# EAGLE design uc board (EAGLE 9.6.2)
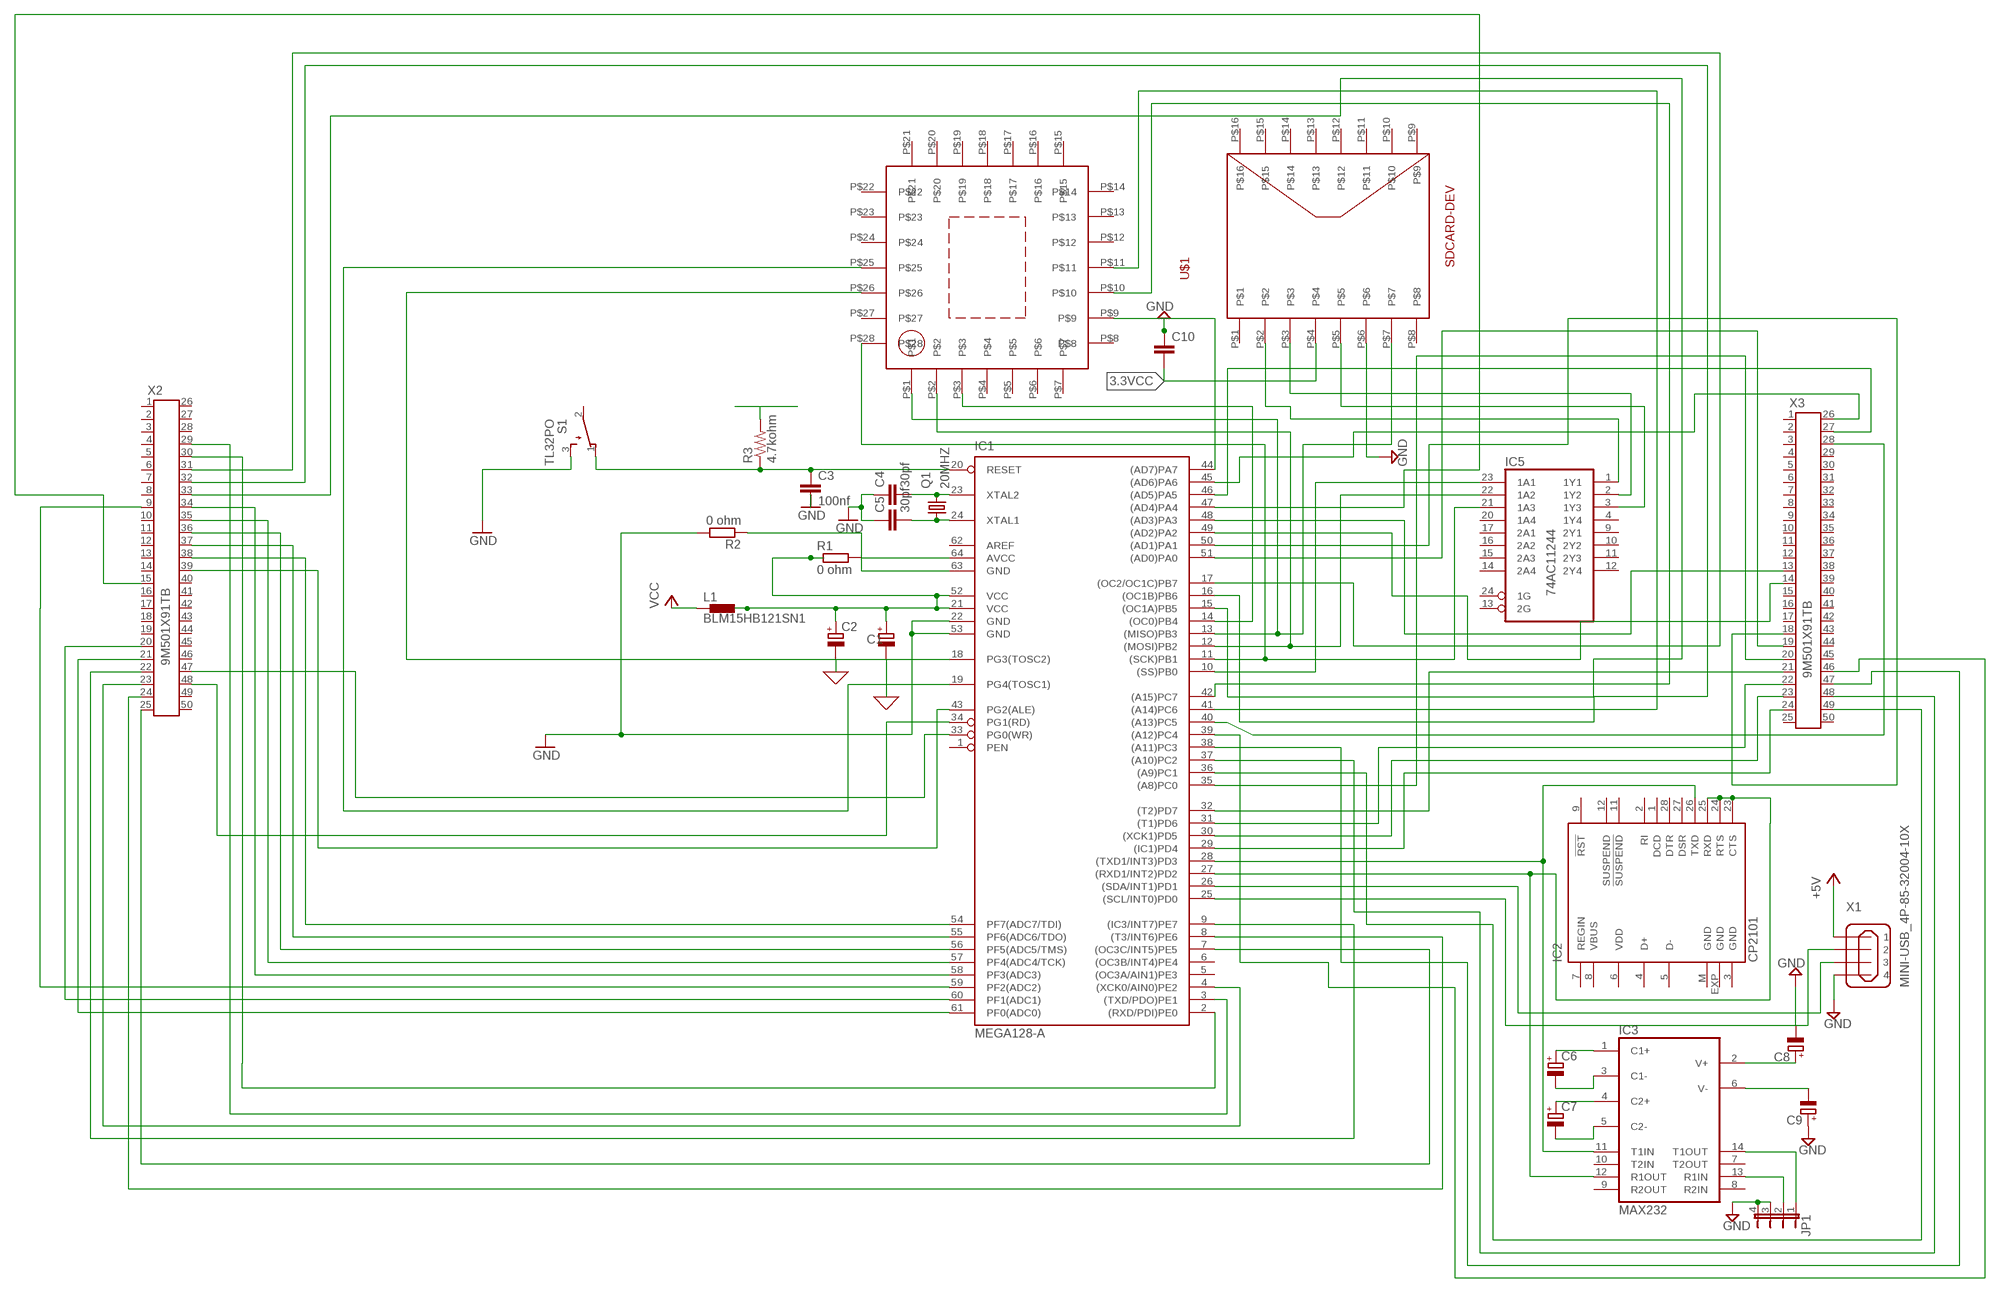
[diagram p0: schematic, sheet 1]

## Parts
C1  CPOL-EU085CS-1AR  [085CS_1AR]
C2  CPOL-EUCT3528  [CT3528]
C3  100nf  C2,5-3  [C2.5-3]
C4  30pf  C2,5-3  [C2.5-3]
C5  30pf  C2,5-3  [C2.5-3]
C6  CPOL-EU085CS-1AR  [085CS_1AR]
C7  CPOL-EU085CS-1AR  [085CS_1AR]
C8  CPOL-EU085CS-1AR  [085CS_1AR]
C9  CPOL-EU085CS-1AR  [085CS_1AR]
C10  C2,5-3  [C2.5-3]
IC1  MEGA128-A  [TQFP64]
IC2  CP2101  [MLP28]
IC3  MAX232  [DIL16]
IC5  74AC11244  [DIL24-6]
JP1  JP4E  [JP4]
L1  BLM15HB121SN1  [0402]
Q1  20MHZ  KX-4  [1.6X1.2]
R1  0 ohm  R-EU_0204/2V  [0204V]
R2  0 ohm  R-EU_0204/2V  [0204V]
R3  4.7kohm  R-US_0204/2V  [0204V]
S1  TL32PO  [TL3XPO]
U$1  SDCARD-DEV  [SDCARD-FOOT]
U$2  CC2520-ZIGBEE-DEV  [CC2520-ZIGBEE-FOOT]
X1  MINI-USB_4P-85-32004-10X  [85-32004-10X]
X2  9M501X91TB  [9M501X91]
X3  9M501X91TB  [9M501X91]

## Nets
0: C1.- C2.- ; supply symbol labelled GND
3.3VCC: C10.2 U$1.P$4
+5V: X1.1
GND: C3.2 C4.1 C5.1 C8.- C9.+ C10.1 IC1.22(GND) IC1.53(GND) JP1.3 JP1.4 R2.2 S1.3(S) U$1.P$6 X1.4
N$1: IC1.14((OC0)PB4) U$2.P$3
N$2: IC1.28((TXD1/INT3)PD3) IC2.26(TXD) IC3.11(T1IN)
N$3: C3.1 IC1.20(RESET) R3.1 S1.1(O)
N$4: IC1.64(AVCC) R1.2
N$5: IC1.27((RXD1/INT2)PD2) IC2.23(CTS) IC2.24(RTS) IC2.25(RXD) IC3.12(R1OUT)
N$6: IC1.63(GND) R2.1
N$7: R3.2
N$9: C4.2 IC1.23(XTAL2) Q1.3
N$10: C5.2 IC1.24(XTAL1) Q1.1
N$11: C6.+ IC3.1(C1+)
N$12: IC3.14(T1OUT) JP1.1
N$13: IC3.13(R1IN) JP1.2
N$14: C6.- IC3.3(C1-)
N$15: C7.+ IC3.4(C2+)
N$16: C8.+ IC3.2(V+)
N$17: C7.- IC3.5(C2-)
N$18: C9.- IC3.6(V-)
N$19: IC1.11((SCK)PB1) IC5.21(1A3) U$2.P$28
N$20: IC1.12((MOSI)PB2) IC5.22(1A2) U$2.P$2
N$21: IC1.10((SS)PB0) IC5.23(1A1)
N$22: IC1.13((MISO)PB3) U$1.P$7 U$2.P$1
N$23: IC5.2(1Y2) U$1.P$3
N$24: IC5.3(1Y3) U$1.P$5
N$25: IC5.1(1Y1) U$1.P$2
N$26: IC1.19(PG4(TOSC1)) U$2.P$25
N$27: C1.+ C2.+ IC1.21(VCC) IC1.52(VCC) L1.2 R1.1
N$28: IC1.18(PG3(TOSC2)) U$2.P$26
N$29: IC1.44((AD7)PA7) U$2.P$9
N$30: IC1.42((A15)PC7) U$2.P$10
N$31: IC1.41((A14)PC6) U$2.P$11
N$32: IC1.26((SDA/INT1)PD1) X1.3
N$33: IC1.25((SCL/INT0)PD0) X1.2
N$34: IC1.43(PG2(ALE)) X2.39
N$35: IC1.54(PF7(ADC7/TDI)) X2.38
N$36: IC1.55(PF6(ADC6/TDO)) X2.37
N$37: IC1.56(PF5(ADC5/TMS)) X2.36
N$38: IC1.57(PF4(ADC4/TCK)) X2.35
N$39: IC1.58(PF3(ADC3)) X2.34
N$40: IC1.15((OC1A)PB5) X2.33
N$41: IC1.2((RXD/PDI)PE0) X2.30
N$42: IC1.16((OC1B)PB6) X2.32
N$43: IC1.17((OC2/OC1C)PB7) X2.31
N$44: IC1.3((TXD/PDO)PE1) X2.29
N$45: IC1.46((AD5)PA5) X3.27
N$46: IC1.45((AD6)PA6) X3.26
N$47: IC1.40((A13)PC5) X3.28
N$48: IC1.29((IC1)PD4) X3.24
N$49: IC1.31((T1)PD6) X3.22
N$50: IC1.30((XCK1)PD5) X3.23
N$51: IC1.32((T2)PD7) X3.21
N$52: IC1.35((A8)PC0) X3.20
N$53: IC1.7((OC3C/INT5)PE5) X2.25
N$54: IC1.51((AD0)PA0) X3.19
N$55: IC1.50((AD1)PA1) X3.18
N$56: IC1.8((T3/INT6)PE6) X2.24
N$57: IC1.36((A9)PC1) X3.49
N$58: IC1.37((A10)PC2) X3.48
N$59: IC1.38((A11)PC3) X3.47
N$60: IC1.39((A12)PC4) X3.46
N$61: IC1.4((XCK0/AIN0)PE2) X2.23
N$62: IC1.9((IC3/INT7)PE7) X2.22
N$63: IC1.61(PF0(ADC0)) X2.21
N$64: IC1.60(PF1(ADC1)) X2.20
N$65: IC1.47((AD4)PA4) X2.15
N$66: IC1.34(PG1(RD)) X2.48
N$67: IC1.48((AD3)PA3) X3.13
N$68: IC1.49((AD2)PA2) X3.14
N$69: IC1.33(PG0(WR)) X2.47
N$70: IC1.59(PF2(ADC2)) X2.9
VCC: L1.1
Unconnected: IC1.1(PEN) IC1.5((OC3A/AIN1)PE3) IC1.6((OC3B/INT4)PE4) IC1.62(AREF) IC2.1(DCD) IC2.2(RI) IC2.4(D+) IC2.5(D-) IC2.7(REGIN) IC2.8(VBUS) IC2.9(!RST) IC2.11(!SUSPEND) IC2.12(SUSPEND) IC2.27(DSR) IC2.28(DTR) IC3.7(T2OUT) IC3.8(R2IN) IC3.9(R2OUT) IC3.10(T2IN) IC5.4(1Y4) IC5.9(2Y1) IC5.10(2Y2) IC5.11(2Y3) IC5.12(2Y4) IC5.13(2G) IC5.14(2A4) IC5.15(2A3) IC5.16(2A2) IC5.17(2A1) IC5.20(1A4) IC5.24(1G) S1.2(P) U$1.P$1 U$1.P$8 U$1.P$9 U$1.P$10 U$1.P$11 U$1.P$12 U$1.P$13 U$1.P$14 U$1.P$15 U$1.P$16 U$2.P$4 U$2.P$5 U$2.P$6 U$2.P$7 U$2.P$8 U$2.P$12 U$2.P$13 U$2.P$14 U$2.P$15 U$2.P$16 U$2.P$17 U$2.P$18 U$2.P$19 U$2.P$20 U$2.P$21 U$2.P$22 U$2.P$23 U$2.P$24 U$2.P$27 X2.1 X2.2 X2.3 X2.4 X2.5 X2.6 X2.7 X2.8 X2.10 X2.11 X2.12 X2.13 X2.14 X2.16 X2.17 X2.18 X2.19 X2.26 X2.27 X2.28 X2.40 X2.41 X2.42 X2.43 X2.44 X2.45 X2.46 X2.49 X2.50 X3.1 X3.2 X3.3 X3.4 X3.5 X3.6 X3.7 X3.8 X3.9 X3.10 X3.11 X3.12 X3.15 X3.16 X3.17 X3.25 X3.29 X3.30 X3.31 X3.32 X3.33 X3.34 X3.35 X3.36 X3.37 X3.38 X3.39 X3.40 X3.41 X3.42 X3.43 X3.44 X3.45 X3.50

## Power pins joined to a net without a drawn wire
GND: IC2.3(GND) IC2.EXP(GND) IC2.M(GND) IC3.15(GND) IC5.5(GND) IC5.6(GND) IC5.7(GND) IC5.8(GND)
VCC: IC3.16(VCC) IC5.18(VCC) IC5.19(VCC)
VDD: IC2.6(VDD)

## Library data of the parts
C1 C2 C6-C9 = rcl:CPOL-EU: POLARIZED CAPACITOR, European symbol; SPICEPREFIX: C
C3-C5 C10 = capacitor-wima:C: CAPACITOR naming: grid - package width
IC1 = atmel:MEGA128: MICROCONTROLLER 128 Kbytes FLASH 4 Kbytes SRAM 4 Kbytes EEPROM DUAL USART 8-channel 10 bit ADC Source: avr.lbr; MPN: ATMEGA128-16AU; OC_FARNELL: 9171118; OC_NEWARK: 95K7364
IC2 = silabs:CP210*: Single-Chip USB to UART Bridge Source: www.silabs.com .. CP2101.pdf / cp2102.pdf; MF: FARNELL; MPN: CP2102-GM; OC_FARNELL: 9282130; OC_NEWARK: 30K5635
IC3 = maxim:MAX232: RS232 TRANSCEIVER; MF: MAXIM; MPN: MAX232ACPE+; OC_FARNELL: 9723773; OC_NEWARK: 68K4544
IC5 = 74ac-logic:74AC11244: Octal BUFFER/DRIVER
JP1 = jumper:JP4E: JUMPER
L1 = inductors:BLM15H: EMIFIL (R) Chip Ferrite Bead for GHz Noise Source: http://www.murata.com/ Ferrite Bead BLM15H.pdf
Q1 = crystal-geyer_V1_0:KX: Quartz Crystals (MHz) SMD: KX - Serie Model Size l/w/h [mm] Frequency Range Frequency Stability Temp. Range [°C] Load Capacitance AECQ 200 availabel Datasheet KX-4 KX-5 KX-6 KX-7 KX-9A KX-9B KX-12A KX-12B KX-13 KX-20 KX-K KX-KS 1.6/1.2/0.3 2.0/1.6/0.45 2.5/2.0/0.55 3.2/2.5/0.8 5.0/3.2/1.0 5.0/3.2/1.1 6.0/3.5/1.1 6.0/3.5/1.0 7.0/5.0 /1.3 11.6/5.5/1.6 12.3/4.5/4.2 12.3/4.5/3.2 24.0 ~ 80.0 MHz 16.0 ~ 80.0 MHz 12.0 ~ 80.0 MHz 8.0 ~ 60.0 MHz 7,68 ~ 300,0 MHz 8,0 ~ 50,0 MHz 8,0 ~ 150,0 MHz 8,0 ~ 50,0 MHz 6,0 ~ 160,0 MHz 3,579 ~ 25,0 MHz 3,579 ~ 70,0 MHz 3,579 ~ 70,0 MHz ±10 … ±50ppm ±10 … ±50ppm ±10 … ±50ppm ±10 … ±50ppm ±10 … ±50ppm ±10 … ±50ppm ±10 … ±50ppm ±10 … ±50ppm ±10 … ±50ppm ±50ppm ±10 … ±50ppm ±10 … ±50ppm (*) -40°C …+85°C (*) -40°C …+125°C (*) -40°C …+125°C (*) -40°C …+125°C (*) -40°C …+105°C (*) -40°C …+105°C (*) -40°C …+125°C (*) -40°C …+105°C (*) -40°C …+105°C (*) -40°C …+105°C (*) -40°C …+85°C (*) -40°C …+85°C 8, 8…16 8, 8…16 10, 8…16 12, 7…20 16, 10…20 16, 10…20 16, 10…20 16, 12…20 16, 12…20 16, 12…20 16, 12…30 16, 12…30 - yes yes yes - - - - - - - - KX-4.pdf <http://www.geyer-electronic.de/uploads/tx_userartikelfrequenz/GEYER-KX-4.pdf> KX-5.pdf <http://www.geyer-electronic.de/uploads/tx_userartikelfrequenz/GEYER-KX-5.pdf> KX-6.pdf <http://www.geyer-electronic.de/uploads/tx_userartikelfrequenz/GEYER-KX-6.pdf> KX-7.pdf <http://www.geyer-electronic.de/uploads/tx_userartikelfrequenz/GEYER-KX-7.pdf> KX-9A.pdf <http://www.geyer-electronic.de/uploads/tx_userartikelfrequenz/GEYER-KX-9A.pdf> KX-9B.pdf <http://www.geyer-electronic.de/uploads/tx_userartikelfrequenz/GEYER-KX-9B.pdf> KX-12A.pdf <http://www.geyer-electronic.de/uploads/tx_userartikelfrequenz/GEYER-KX-12A.pdf> KX-12B.pdf <http://www.geyer-electronic.de/uploads/tx_userartikelfrequenz/GEYER-KX-12B.pdf> KX-13.pdf <http://www.geyer-electronic.de/uploads/tx_userartikelfrequenz/GEYER-KX-13.pdf> KX-20.pdf <http://www.geyer-electronic.de/uploads/tx_userartikelfrequenz/GEYER-KX-20.pdf> KX-K.pdf <http://www.geyer-electronic.de/uploads/tx_userartikelfrequenz/GEYER-KX-K.pdf> KX-KS.pdf <http://www.geyer-electronic.de/uploads/tx_userartikelfrequenz/GEYER-KX-KS.pdf> <http://www.geyer-electronic.de/fileadmin/template/img/logo-geyer-electronic.png> Details see: http://www.geyer-electronic.de/Frequenz-Produkte.9.0.html Created 2016-06-07, Hans Locher 2016 (C) Geyer Quartz Technology KX4,KX5,KX6,KX7,KX9A,KX9B,KX12A,KX12B,KX13,KX20,KXK,KXKS;1612;2016;2520;3225;5032;6035;7050;11655;12345;1,6x1,2;2,0x1,6;2,5x2,0;3,2x2,5;5,0x3,2;6,0x3,5;7,0x5,0;11,6x5,5;12,3x4,5;12,3x4,5;1.6x1.2;2.0x1.6;2.5x2.0;3.2x2.5;5.0x3.2;6.0x3.5;7.0x5.0;11.6x5.5;12.3x4.5;12.3x4.5;
R1 R2 = rcl:R-EU_: RESISTOR, European symbol; SPICEPREFIX: R
R3 = rcl:R-US_: RESISTOR, American symbol; SPICEPREFIX: R
S1 = switch:TL32PO: TINY SWITCH ON - MOM Source: http://www2.produktinfo.conrad.com/datenblaetter/700000-724999/705152-da-01-de-Subminiaturschalter_TL_36YO.pdf
U$1 = sd-card:SDCARD-DEV
U$2 = cc2520-zigbee:CC2520-ZIGBEE-DEV
X1 = con-cypressindustries:MINI-USB_4P-: MINI USB 4 Pol. Source: www.cypressindustries.com; OC_FARNELL: unknown; OC_NEWARK: unknown
X2 X3 = con-3m:9M501X91TB: CONNECTOR PCMCIA-CompactFlash; OC_FARNELL: unknown; OC_NEWARK: unknown

## Board
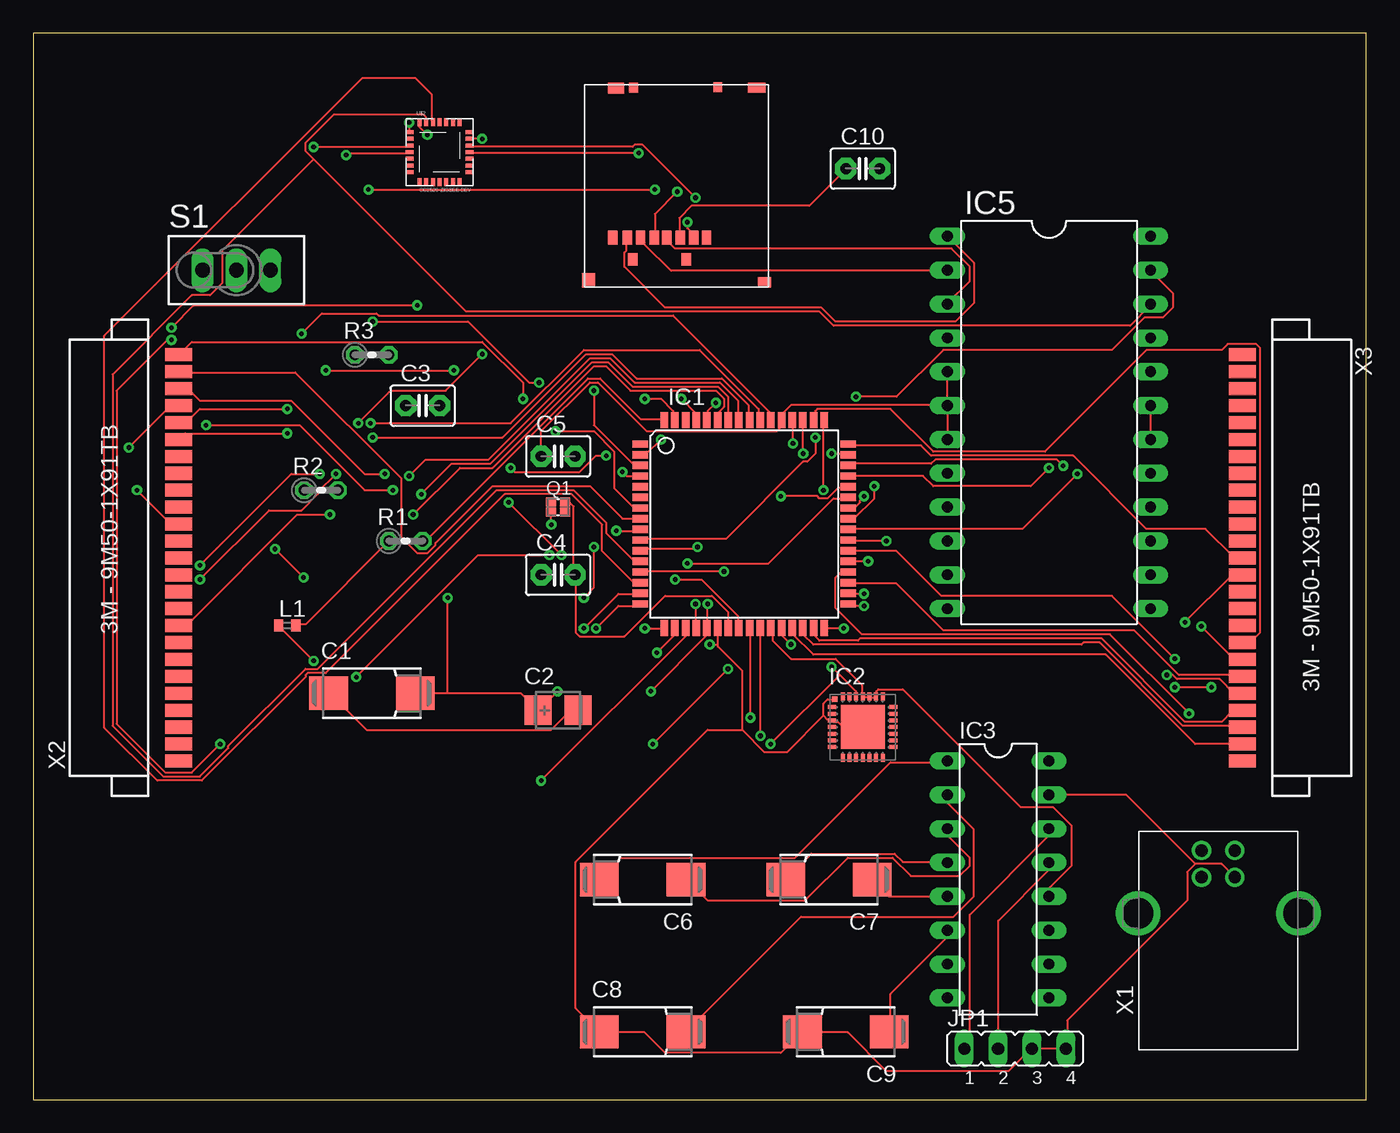
[diagram p1: board, top side]
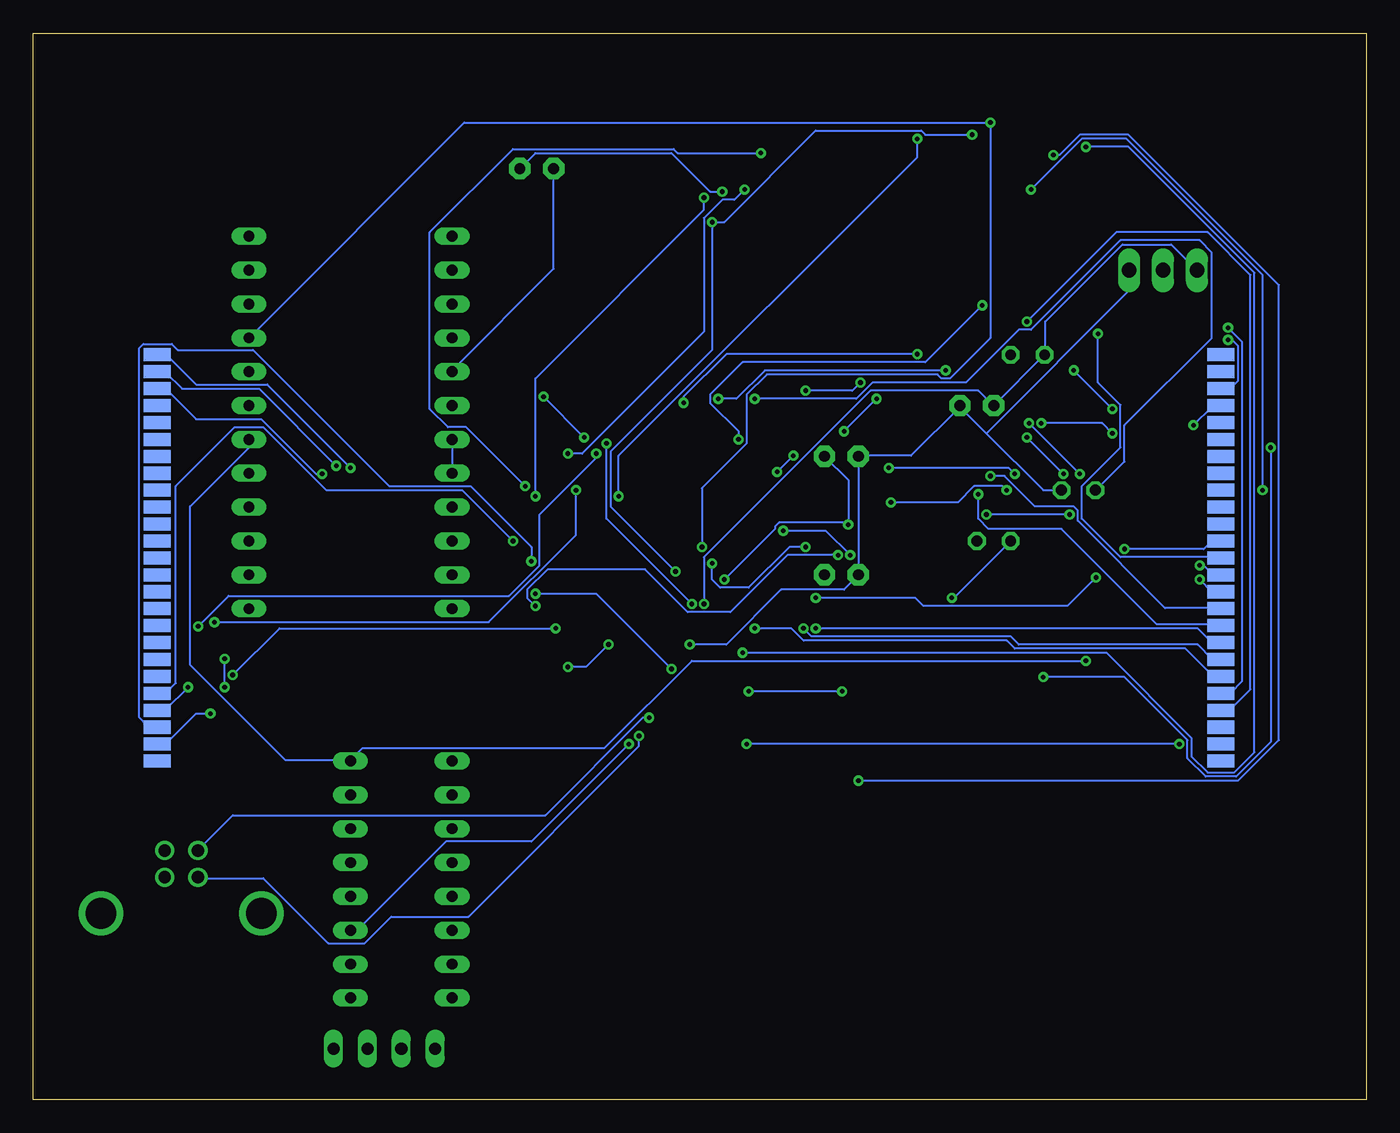
[diagram p2: board, bottom side, seen from below]

Size 100 x 80 mm. Coordinates in mm from the lower left corner, seen from the top.
Outline: 0,0 100,0 100,80 0,80 0,0
Copper layers (1*16): Top 0.035mm / dielectric 1.5mm / Bottom 0.035mm
Design rules "default": minimum track width 6mil, minimum drill 0.35mm, track to track 6mil, track to pad 6mil, pad to pad 6mil, via to via 6mil, smd to smd 6mil, copper to edge 40mil, drill to drill 6mil, minimum pad ring 10mil, minimum via ring 8mil, stop-mask expansion 4mil, vias tented up to drill 0mil, thermal gap 10mil

### Footprints (pad centres in the part's own frame; a part is rotated, then mirrored left to right if it is on the bottom)
085CS_1AR = smd 2.9 x 2.5: + 3.25,0; - -3.25,0
CT3528 = smd 2 x 2.2: + -1.5,0; - 1.5,0
C2.5-3 = drill 0.813 pad 1.6 octagon: 1 -1.27,0; 2 1.27,0
TQFP64 = smd 1.194 x 0.559: 1 -7.8,6; 2 -7.8,5.2; 3 -7.8,4.4; 4 -7.8,3.6; 5 -7.8,2.8; 6 -7.8,2; 7 -7.8,1.2; 8 -7.8,0.4; 9 -7.8,-0.4; 10 -7.8,-1.2; 11 -7.8,-2; 12 -7.8,-2.8; 13 -7.8,-3.6; 14 -7.8,-4.4; 15 -7.8,-5.2; 16 -7.8,-6; 33 7.8,-6; 34 7.8,-5.2; 35 7.8,-4.4; 36 7.8,-3.6; 37 7.8,-2.8; 38 7.8,-2; 39 7.8,-1.2; 40 7.8,-0.4; 41 7.8,0.4; 42 7.8,1.2; 43 7.8,2; 44 7.8,2.8; 45 7.8,3.6; 46 7.8,4.4; 47 7.8,5.2; 48 7.8,6 | smd 0.559 x 1.194: 17 -6,-7.8; 18 -5.2,-7.8; 19 -4.4,-7.8; 20 -3.6,-7.8; 21 -2.8,-7.8; 22 -2,-7.8; 23 -1.2,-7.8; 24 -0.4,-7.8; 25 0.4,-7.8; 26 1.2,-7.8; 27 2,-7.8; 28 2.8,-7.8; 29 3.6,-7.8; 30 4.4,-7.8; 31 5.2,-7.8; 32 6,-7.8; 49 6,7.8; 50 5.2,7.8; 51 4.4,7.8; 52 3.6,7.8; 53 2.8,7.8; 54 2,7.8; 55 1.2,7.8; 56 0.4,7.8; 57 -0.4,7.8; 58 -1.2,7.8; 59 -2,7.8; 60 -2.8,7.8; 61 -3.6,7.8; 62 -4.4,7.8; 63 -5.2,7.8; 64 -6,7.8
MLP28 = smd 0.6 x 0.3: 1 -2.3,1.5; 2 -2.3,1; 3 -2.3,0.5; 4 -2.3,0; 5 -2.3,-0.5; 6 -2.3,-1; 7 -2.3,-1.5; 15 2.3,-1.5; 16 2.3,-1; 17 2.3,-0.5; 18 2.3,0; 19 2.3,0.5; 20 2.3,1; 21 2.3,1.5 | smd 0.3 x 0.6: 8 -1.5,-2.3; 9 -1,-2.3; 10 -0.5,-2.3; 11 0,-2.3; 12 0.5,-2.3; 13 1,-2.3; 14 1.5,-2.3; 22 1.5,2.3; 23 1,2.3; 24 0.5,2.3; 25 0,2.3; 26 -0.5,2.3; 27 -1,2.3; 28 -1.5,2.3 | smd 3.3 x 3.3: EXP 0,0 | smd 0.435 x 0.435: M -2.103,2.103
DIL16 = drill 0.813 long: 1 -8.89,-3.81; 2 -6.35,-3.81; 3 -3.81,-3.81; 4 -1.27,-3.81; 5 1.27,-3.81; 6 3.81,-3.81; 7 6.35,-3.81; 8 8.89,-3.81; 9 8.89,3.81; 10 6.35,3.81; 11 3.81,3.81; 12 1.27,3.81; 13 -1.27,3.81; 14 -3.81,3.81; 15 -6.35,3.81; 16 -8.89,3.81
DIL24-6 = drill 0.813 long: 1 -13.97,-7.62; 2 -11.43,-7.62; 3 -8.89,-7.62; 4 -6.35,-7.62; 5 -3.81,-7.62; 6 -1.27,-7.62; 7 1.27,-7.62; 8 3.81,-7.62; 9 6.35,-7.62; 10 8.89,-7.62; 11 11.43,-7.62; 12 13.97,-7.62; 13 13.97,7.62; 14 11.43,7.62; 15 8.89,7.62; 16 6.35,7.62; 17 3.81,7.62; 18 1.27,7.62; 19 -1.27,7.62; 20 -3.81,7.62; 21 -6.35,7.62; 22 -8.89,7.62; 23 -11.43,7.62; 24 -13.97,7.62
JP4 = drill 0.914 long: 1 -3.81,0; 2 -1.27,0; 3 1.27,0; 4 3.81,0
0402 = smd 0.7 x 0.9: 1 -0.65,0; 2 0.65,0
1.6X1.2 = smd 0.75 x 0.65: 1 -0.525,-0.375; 2 0.525,-0.375; 3 0.525,0.375; 4 -0.525,0.375
0204V = drill 0.813 octagon: 1 -1.27,0; 2 1.27,0
TL3XPO = drill 1.1 pad 1.422 long: 1 -2.54,0; 2 0,0; 3 2.54,0
SDCARD-FOOT = smd 0.7 x 1.05: P$1 -4.775,3.725; P$2 -3.7,3.725; P$3 -2.7,3.725; P$4 -1.675,3.725; P$5 -0.725,3.725; P$6 0.275,3.725; P$7 1.3,3.725; P$8 2.25,3.725 | smd 0.7 x 0.95: P$9 -3.275,2.075; P$10 0.725,2.075 | smd 0.95 x 1.1: P$11 -6.6,0.5 | smd 1.2 x 0.85: P$12 -4.55,14.925 | smd 0.95 x 0.8: P$13 6.6,0.35 | smd 0.65 x 0.75: P$14 -3.225,14.975; P$16 3.1,15 | smd 1.3 x 0.75: P$15 6.025,14.975
CC2520-ZIGBEE-FOOT = smd 0.3 x 0.6: P$1 -1.5,4.75; P$2 -1,4.75; P$3 -0.5,4.75; P$4 0,4.75; P$5 0.5,4.75; P$6 1,4.75; P$7 1.5,4.75; P$15 1.5,0.25; P$16 1,0.25; P$17 0.5,0.25; P$18 0,0.25; P$19 -0.5,0.25; P$20 -1,0.25; P$21 -1.5,0.25 | smd 0.6 x 0.3: P$8 2.25,4; P$9 2.25,3.5; P$10 2.25,3; P$11 2.25,2.5; P$12 2.25,2; P$13 2.25,1.5; P$14 2.25,1; P$22 -2.25,1; P$23 -2.25,1.5; P$24 -2.25,2; P$25 -2.25,2.5; P$26 -2.25,3; P$27 -2.25,3.5; P$28 -2.25,4
85-32004-10X = drill 0.92 pad 1.27: 1 4.71,-1.25; 2 4.71,1.25; 3 2.71,1.25; 4 2.71,-1.25 | drill 2.3 pad 3: M1 0,6.02; M2 0,-6.02
9M501X91 = smd 0.98 x 2.03: 1 -15.24,-3.29; 2 -13.97,-3.29; 3 -12.7,-3.29; 4 -11.43,-3.29; 5 -10.16,-3.29; 6 -8.89,-3.29; 7 -7.62,-3.29; 8 -6.35,-3.29; 9 -5.08,-3.29; 10 -3.81,-3.29; 11 -2.54,-3.29; 12 -1.27,-3.29; 13 0,-3.29; 14 1.27,-3.29; 15 2.54,-3.29; 16 3.81,-3.29; 17 5.08,-3.29; 18 6.35,-3.29; 19 7.62,-3.29; 20 8.89,-3.29; 21 10.16,-3.29; 22 11.43,-3.29; 23 12.7,-3.29; 24 13.97,-3.29; 25 15.24,-3.29 | smd 0.98 x 2.03 bottom: 26 -15.24,-3.29; 27 -13.97,-3.29; 28 -12.7,-3.29; 29 -11.43,-3.29; 30 -10.16,-3.29; 31 -8.89,-3.29; 32 -7.62,-3.29; 33 -6.35,-3.29; 34 -5.08,-3.29; 35 -3.81,-3.29; 36 -2.54,-3.29; 37 -1.27,-3.29; 38 0,-3.29; 39 1.27,-3.29; 40 2.54,-3.29; 41 3.81,-3.29; 42 5.08,-3.29; 43 6.35,-3.29; 44 7.62,-3.29; 45 8.89,-3.29; 46 10.16,-3.29; 47 11.43,-3.29; 48 12.7,-3.29; 49 13.97,-3.29; 50 15.24,-3.29

### Placement (x,y rotation side)
C1  25.4,30.48 0 top
C2  39.37,29.21 0 top
C3  29.21,52.07 0 top
C4  39.37,39.37 0 top
C5  39.37,48.26 0 top
C6  45.72,16.51 180 top
C7  59.69,16.51 180 top
C8  45.72,5.08 0 top
C9  60.96,5.08 180 top
C10  62.23,69.85 0 top
IC1  53.34,43.18 0 top
IC2  62.23,27.94 0 top
IC3  72.39,16.51 270 top
IC5  76.2,50.8 270 top
JP1  73.66,3.81 0 top
L1  19.05,35.56 0 top
Q1  39.37,44.45 0 top
R1  27.94,41.91 0 top
R2  21.59,45.72 0 top
R3  25.4,55.88 0 top
S1  15.24,62.23 0 top
U$1  48.26,60.96 0 top
U$2  30.48,68.58 0 top
X1  88.9,13.97 90 top
X2  7.62,40.64 90 top
X3  93.98,40.64 270 top

### Tracks (layer width: path | path; a pad name or v marks a point on that pad's centre or on a via)
0
  Top 0.152: C2.- 40.84,29.11 40.23,29.11 38.86,27.74 24.99,27.74 22.25,30.48 C1.-
3.3VCC  (via drill 0.35)
  Top 0.152: v48.31,68.12 46.63,66.45 46.63,64.77 U$1.P$4
  Bottom 0.152: v48.31,68.12 49.23,68.12 52.12,71.02 62.33,71.02 C10.2
GND  (via drill 0.35)
  Top 0.152: 59.28,28.8 59.28,29.72 59.59,30.02 60.05,30.02 IC2.M | 59.28,28.8 59.59,28.5 59.89,28.5 IC2.3 60.05,28.35 60.35,28.35 60.66,28.04 62.18,28.04 IC2.EXP | 51.36,34.14 51.36,33.98 53.19,32.16 53.19,27.74 | 51.36,34.14 51.36,35.36 IC1.22 | 53.19,27.74 54.86,26.06 56.54,26.06 59.28,28.8 | IC3.15 81.99,22.86 87.17,17.68 | 87.17,17.68 89.15,17.68 90.07,16.76 X1.4 | 87.17,17.68 86.56,17.07 86.56,14.94 77.57,5.94 77.57,3.81 JP1.4 JP1.3 74.83,3.81 73.15,2.13 64.01,2.13 61.11,5.03 57.76,5.03 C9.+ 57.61,5.03 56.08,3.5 47.4,3.5 45.87,5.03 42.52,5.03 C8.- 42.37,5.18 40.69,6.86 40.69,17.83 50.6,27.74 53.19,27.74 | U$1.P$6 48.46,64.77 48.46,66.14 49.38,67.06 58.22,67.06 60.96,69.8 C10.1 | 68.58,52.12 56.84,52.12 56.24,51.51 56.24,51.05 IC1.53 56.08,50.9 56.08,50.44 55.78,50.14 46.02,50.14 42.37,53.8 41.76,53.8 38.1,50.14 C5.1 | 68.58,52.12 IC5.5 | 68.58,52.12 IC5.6 IC5.7 | v50.75,34.14 51.36,34.14
  Bottom 0.152: IC5.7 IC5.8 | C10.1 60.96,62.33 68.58,54.71 IC5.5 | R2.2 24.23,45.72 28.5,49.99 | 30.48,51.97 28.5,49.99 | 28.5,49.99 17.83,60.66 17.83,62.18 S1.3 | 30.48,51.97 34.14,48.31 38.1,48.31 C5.1 C4.1 38.1,39.32 39.17,38.25 43.89,38.25 48.01,34.14 v50.75,34.14 | 30.48,51.97 C3.2
N$1
  Top 0.152: U$2.P$3 29.87,73.46 29.87,75.44 28.65,76.66 24.69,76.66 5.33,57.3 5.33,27.89 9.3,23.93 12.65,23.93 20.42,31.7 20.42,31.85 20.57,32 21.95,32 35.36,45.41 40.39,45.41 42.67,43.13 42.67,41.15 44.96,38.86 45.41,38.86 IC1.14
N$2  (via drill 0.35)
  Top 0.152: v59.89,32.46 60.5,31.85 | 60.5,31.85 61.72,30.63 61.72,30.33 IC2.26 | v56.84,34.14 56.24,34.75 56.24,35.36 IC1.28 | 60.5,31.85 v55.32,26.67
  Bottom 0.152: v59.89,32.46 58.52,32.46 v56.84,34.14 | v55.32,26.67 62.64,19.36 69.04,19.36 75.59,12.8 76.2,12.8 IC3.11
N$3  (via drill 0.35)
  Top 0.152: v49.68,37.19 49.68,35.51 IC1.20
  Bottom 0.152: v49.68,37.19 49.68,40.69 37.19,53.19 29.11,53.19 28.04,52.12 C3.1 R3.1 24.08,55.93 24.08,58.37 18.29,64.16 14.63,64.16 S1.1
N$4
  Top 0.152: R1.2 29.41,41.91 41.6,54.1 42.52,54.1 45.57,51.05 47.24,51.05 IC1.64
N$5
  Top 0.152: IC1.27 55.47,35.36 55.47,34.44 56.84,33.07 60.2,33.07 62.18,31.09 62.18,30.33 IC2.25 62.33,30.18 62.64,30.18 IC2.24 62.79,30.18 63.09,30.18 IC2.23 63.25,30.33 63.25,30.63 63.4,30.79 65.23,30.79 74.07,21.95 76.5,21.95 77.88,20.57 77.88,17.53 76.2,15.85 IC3.12
N$6  (via drill 0.35)
  Top 0.152: v45.87,52.58 47.09,52.58 48.01,51.66 48.01,51.05 IC1.63
  Bottom 0.152: v45.87,52.58 38.25,52.58 37.03,53.8 30.02,53.8 26.06,57.76 25.15,57.76 18.44,64.47 12.5,64.47 11.58,63.55 11.58,57.15 18.14,50.6 18.14,47.85 20.27,45.72 R2.1
N$9
  Top 0.152: Q1.3 39.93,44.81 40.23,44.81 40.54,44.5 40.54,39.47 C4.2 40.69,39.32 40.69,35.05 41,34.75 44.35,34.75 47.4,37.8 50.9,37.8 52.12,36.58 52.12,35.51 IC1.23
N$10  (via drill 0.35)
  Top 0.152: v38.86,43.13 38.86,44.04 Q1.1 | v48.16,39.01 50.14,39.01 52.88,36.27 52.88,35.51 IC1.24
  Bottom 0.152: 38.86,43.28 38.86,46.48 C5.2 | v48.16,39.01 44.35,42.82 44.35,42.98 44.04,43.28 38.86,43.28 | 38.86,43.28 v38.86,43.13
N$11
  Top 0.152: IC3.1 68.58,25.3 64.31,25.3 57.15,18.14 44.04,18.14 42.52,16.61 C6.+
N$12
  Top 0.152: IC3.14 76.2,19.81 70.26,13.87 70.26,4.12 69.95,3.81 JP1.1
N$13
  Top 0.152: IC3.13 76.2,17.22 72.39,13.41 JP1.2
N$14
  Top 0.152: IC3.3 68.58,19.81 70.26,18.14 70.26,17.53 69.49,16.76 65.84,16.76 64.47,18.14 61.11,18.14 57.91,14.94 50.6,14.94 49.07,16.46 C6.-
N$15
  Top 0.152: IC3.4 68.58,17.83 65.23,17.83 64.62,18.44 58.37,18.44 56.54,16.61 C7.+
N$16
  Top 0.152: IC3.2 68.58,22.25 70.56,20.27 70.56,15.24 69.04,13.72 57.61,13.72 49.07,5.18 C8.+
N$17
  Top 0.152: IC3.5 64.16,15.24 62.94,16.46 C7.-
N$18
  Top 0.152: IC3.6 68.58,12.19 64.31,7.92 64.31,5.18 C9.-
N$19  (via drill 0.35)
  Top 0.152: v28.19,73.3 28.19,72.69 U$2.P$28 | v49.84,41.45 49.68,41.3 45.57,41.3 IC1.11
  Bottom 0.152: IC5.21 67.67,73.3 v28.19,73.3 28.19,57.15 31.24,54.1 31.85,54.1 32.16,54.41 44.96,54.41 46.48,52.88 46.48,49.23 49.84,45.87 v49.84,41.45
N$20
  Top 0.152: 21.03,70.56 32.46,59.13 58.98,59.13 60.05,58.06 82.3,58.06 83.82,59.59 IC5.22 | 21.03,70.56 20.42,71.17 20.42,71.78 22.55,73.91 29.26,73.91 29.41,73.76 29.41,73.46 U$2.P$2 | 21.03,70.56 14.17,63.7 14.17,61.27 13.26,60.35 11.89,60.35 5.94,54.41 5.94,28.04 9.75,24.23 12.5,24.23 14.63,26.36 14.63,26.52 20.42,32.31 21.34,32.31 34.75,45.72 40.54,45.72 42.98,43.28 42.98,42.52 45.11,40.39 45.41,40.39 IC1.12
N$21  (via drill 0.35)
  Top 0.152: v58.67,49.68 58.67,48.46 58.06,47.85 57.76,47.85 51.97,42.06 45.57,42.06 IC1.10 | v61.72,52.73 64.77,52.73 68.28,56.24 80.92,56.24 83.36,58.67 84.73,58.67 85.5,59.44 85.5,60.5 83.82,62.18 IC5.23
  Bottom 0.152: v61.72,52.73 v58.67,49.68
N$22  (via drill 0.35)
  Top 0.152: v29.57,72.39 28.96,73 28.96,73.3 U$2.P$1 | v49.07,65.84 49.07,65.38 49.68,64.77 U$1.P$7 | v51.82,39.62 45.57,39.62 IC1.13
  Bottom 0.152: v29.57,72.39 33.07,72.39 33.38,72.69 41.3,72.69 48.16,65.84 v49.07,65.84 49.07,56.24 56.69,48.62 56.69,44.5 v51.82,39.62
N$23
  Top 0.152: U$1.P$3 45.57,64.62 45.87,64.31 45.87,64.16 47.85,62.18 68.58,62.18 IC5.2
N$24
  Top 0.152: U$1.P$5 47.55,64.62 47.85,64.31 47.85,64.16 48.16,63.86 68.89,63.86 70.26,62.48 70.26,61.42 68.58,59.74 IC5.3
N$25
  Top 0.152: IC5.1 70.56,62.79 70.56,59.74 69.19,58.37 60.2,58.37 59.13,59.44 47.4,59.44 44.35,62.48 44.35,63.55 44.5,63.7 44.5,64.62 U$1.P$2
N$26  (via drill 0.35)
  Top 0.152: v23.47,70.87 23.62,71.02 28.19,71.02 U$2.P$25 | v38.1,23.93 48.92,34.75 48.92,35.36 IC1.19
  Bottom 0.152: v23.47,70.87 23.01,70.87 21.49,72.39 17.83,72.39 6.55,61.11 6.55,26.98 9.6,23.93 v38.1,23.93
N$27  (via drill 0.35)
  Top 0.152: R1.1 20.42,35.66 19.81,35.66 L1.2 | v46.33,30.63 50.44,34.75 50.44,35.36 IC1.21 50.6,35.51 v50.6,37.19 | v39.32,30.63 37.95,29.26 C2.+ 37.8,29.26 36.58,30.48 31.09,30.48 | v57,49.23 57,50.9 IC1.52 | 31.09,30.48 C1.+ | 31.09,30.48 v31.09,37.64
  Bottom 0.152: v39.32,30.63 v46.33,30.63 | v57,49.23 57,43.59 v50.6,37.19 | R1.1 30.94,37.64 v31.09,37.64
N$28  (via drill 0.35)
  Top 0.152: v21.03,71.48 28.19,71.48 U$2.P$26 | v46.79,33.53 48.01,34.75 48.01,35.36 IC1.18
  Bottom 0.152: v21.03,71.48 17.83,71.48 8.38,62.03 8.38,26.06 9.91,24.54 11.89,24.54 13.11,25.76 13.11,27.13 19.51,33.53 v46.79,33.53
N$29  (via drill 0.35)
  Top 0.152: v33.68,72.08 32.77,72.08 U$2.P$9 | v56.08,45.26 58.83,45.26 58.98,45.11 59.59,45.11 60.35,45.87 61.11,45.87 IC1.44
  Bottom 0.152: v33.68,72.08 33.68,70.71 56.08,48.31 v56.08,45.26
N$30  (via drill 0.35)
  Top 0.152: v49.68,67.67 45.72,71.63 45.11,71.63 44.96,71.48 32.77,71.48 U$2.P$10 | v62.33,45.26 62.03,44.96 62.03,44.81 61.72,44.5 61.27,44.5 IC1.42
  Bottom 0.152: v49.68,67.67 49.68,66.75 62.33,54.1 v62.33,45.26
N$31  (via drill 0.35)
  Top 0.152: v45.41,71.02 32.77,71.02 U$2.P$11 | v63.09,46.02 63.09,45.11 61.57,43.59 61.27,43.59 IC1.41
  Bottom 0.152: v45.41,71.02 51.66,71.02 51.97,71.32 64.01,71.32 70.26,65.08 70.26,51.82 68.89,50.44 67.51,50.44 v63.09,46.02
N$32  (via drill 0.35)
  Top 0.152: v54.56,27.28 54.56,35.36 IC1.26
  Bottom 0.152: v54.56,27.28 54.56,26.52 67.36,13.72 73.15,13.72 75.13,11.73 77.88,11.73 82.75,16.61 87.63,16.61 X1.3
N$33  (via drill 0.35)
  Top 0.152: v53.8,28.65 53.8,35.36 IC1.25
  Bottom 0.152: v53.8,28.65 54.25,28.65 61.57,21.34 85.04,21.34 87.63,18.75 X1.2
N$34  (via drill 0.35)
  Top 0.152: v49.07,40.23 55.17,40.23 60.05,45.11 61.11,45.11 IC1.43 | v42.06,41.45 42.06,38.41 v41.3,37.64 | v18.14,41.3 v20.27,39.17
  Bottom 0.152: v49.07,40.23 49.07,39.01 48.46,38.41 46.33,38.41 43.28,41.45 v42.06,41.45 | v41.3,37.64 33.83,37.64 33.22,37.03 22.4,37.03 v20.27,39.17 | v18.14,41.3 12.19,41.3 11.58,41.91 X2.39
N$35  (via drill 0.35)
  Top 0.152: v20.12,57.45 21.64,58.98 25.76,58.98 25.91,58.83 48.01,58.83 55.32,51.51 55.32,51.05 IC1.54
  Bottom 0.152: v20.12,57.45 20.12,53.8 18.44,52.12 18.44,48.92 21.34,46.02 21.34,43.59 18.44,40.69 10.97,40.69 X2.38
N$36  (via drill 0.35)
  Top 0.152: v25.3,50.75 35.81,50.75 41.3,56.24 49.99,56.24 54.41,51.82 54.41,51.05 IC1.55 | v21.49,46.94 19.36,46.94 v12.5,40.08
  Bottom 0.152: v21.49,46.94 v25.3,50.75 | v12.5,40.08 12.19,40.08 11.58,39.47 10.97,39.47 X2.37
N$37  (via drill 0.35)
  Top 0.152: v25.45,49.68 35.2,49.68 41.45,55.93 43.43,55.93 45.26,54.1 51.66,54.1 53.65,52.12 53.65,51.05 IC1.56 | v22.71,46.94 21.34,45.57 21.34,45.41 20.12,44.2 17.68,44.2 v12.5,39.01
  Bottom 0.152: v22.71,46.94 v25.45,49.68 | v12.5,39.01 11.58,38.1 X2.36
N$38  (via drill 0.35)
  Top 0.152: v28.19,46.79 29.41,48.01 34.14,48.01 41.76,55.63 43.28,55.63 45.11,53.8 51.51,53.8 52.88,52.43 52.88,51.05 IC1.57
  Bottom 0.152: v28.19,46.79 27.13,46.79 24.84,44.5 21.95,44.5 21.64,44.2 21.64,43.43 15.09,36.88 10.97,36.88 X2.35
N$39  (via drill 0.35)
  Top 0.152: v29.11,45.41 31.39,47.7 34.29,47.7 41.91,55.32 43.13,55.32 44.96,53.49 51.36,53.49 52.12,52.73 52.12,51.05 IC1.58
  Bottom 0.152: v29.11,45.41 29.11,43.59 28.35,42.82 22.86,42.82 15.7,35.66 10.97,35.66 X2.34
N$40  (via drill 0.35)
  Top 0.152: v41.3,35.36 43.89,37.95 45.41,37.95 IC1.15
  Bottom 0.152: v41.3,35.36 12.65,35.36 11.58,34.29 X2.33
N$41  (via drill 0.35)
  Top 0.152: v47.09,49.53 46.02,48.46 45.57,48.46 IC1.2 | v28.8,59.59 12.04,59.59 v10.36,57.91
  Bottom 0.152: v47.09,49.53 47.09,50.14 49.23,52.27 49.23,52.88 46.79,55.32 33.07,55.32 v28.8,59.59 | v10.36,57.91 9.3,56.84 9.3,31.39 10.21,30.48 X2.30
N$42  (via drill 0.35)
  Top 0.152: v42.22,35.36 43.89,37.03 45.41,37.03 IC1.16
  Bottom 0.152: v42.22,35.36 41.6,34.75 26.67,34.75 26.06,34.14 12.65,34.14 11.58,33.07 10.97,33.07 X2.32
N$43  (via drill 0.35)
  Top 0.152: v45.87,35.36 47.24,35.36 IC1.17
  Bottom 0.152: v45.87,35.36 43.13,35.36 42.22,34.44 26.98,34.44 26.36,33.83 13.56,33.83 11.58,31.85 10.97,31.85 X2.31
N$44  (via drill 0.35)
  Top 0.152: v42.06,53.19 42.06,50.6 44.96,47.7 45.41,47.7 IC1.3 | v37.95,53.8 37.19,53.8 32.61,58.37 v25.45,58.37
  Bottom 0.152: v42.06,53.19 38.56,53.19 v37.95,53.8 | v25.45,58.37 18.75,65.08 11.89,65.08 8.69,61.87 8.69,30.79 10.21,29.26 10.82,29.26 X2.29
N$45  (via drill 0.35)
  Top 0.152: v77.27,47.55 76.81,48.01 67.67,48.01 67.36,47.7 61.27,47.7 IC1.46
  Bottom 0.152: v77.27,47.55 83.06,53.34 88.85,53.34 90.07,54.56 90.68,54.56 X3.27
N$46  (via drill 0.35)
  Top 0.152: v76.2,47.4 74.83,46.02 67.51,46.02 66.75,46.79 61.27,46.79 IC1.45
  Bottom 0.152: v76.2,47.4 82.45,53.65 87.78,53.65 89.92,55.78 90.68,55.78 X3.26
N$47  (via drill 0.35)
  Top 0.152: v78.33,46.94 74.22,42.82 61.27,42.82 IC1.40
  Bottom 0.152: v78.33,46.94 78.79,46.94 82.91,51.05 87.78,51.05 90.07,53.34 X3.28
N$48
  Top 0.152: X3.24 87.17,26.67 80.47,33.38 58.52,33.38 57,34.9 57,35.36 IC1.29
N$49
  Top 0.152: IC1.31 58.67,35.36 58.67,34.75 58.98,34.44 61.87,34.44 62.03,34.59 80.16,34.59 86.41,28.35 89.15,28.35 89.92,29.11 90.68,29.11 X3.22
N$50
  Top 0.152: IC1.30 57.76,35.36 57.76,34.9 58.52,34.14 78.64,34.14 78.79,34.29 80.01,34.29 86.26,28.04 90.68,28.04 X3.23
N$51  (via drill 0.35)
  Top 0.152: v60.81,35.36 59.44,35.36 IC1.32 | v85.04,31.85 85.5,31.85 85.8,31.55 89,31.55 90.07,30.48 X3.21
  Bottom 0.152: v60.81,35.36 81.53,35.36 v85.04,31.85
N$52
  Top 0.152: IC1.35 61.27,38.71 64.77,38.71 68.28,35.2 82.6,35.2 85.95,31.85 90.68,31.85 X3.20
N$53  (via drill 0.35)
  Top 0.152: v39.17,50.14 42.06,50.14 43.59,48.62 43.59,45.87 44.96,44.5 45.41,44.5 IC1.7 | v36.73,52.58 36.73,53.8 33.68,56.84 11.89,56.84 10.97,55.93 X2.25
  Bottom 0.152: v36.73,52.58 v39.17,50.14
N$54  (via drill 0.35)
  Top 0.152: v57.76,48.46 57.76,50.9 IC1.51 | v87.63,35.51 90.07,33.07 90.68,33.07 X3.19
  Bottom 0.152: v57.76,48.46 57.76,48.16 62.03,43.89 62.03,40.08 64.31,37.8 85.34,37.8 v87.63,35.51
N$55
  Top 0.152: X3.18 91.29,34.29 92.05,35.05 92.05,56.39 91.75,56.69 89.61,56.69 89.15,56.24 83.52,56.24 75.89,48.62 67.51,48.62 64.31,51.82 58.83,51.82 58.67,51.66 58.67,51.05 IC1.50
N$56
  Top 0.152: IC1.8 45.41,43.59 44.2,43.59 41.76,46.02 34.44,46.02 30.18,41.76 30.18,41.6 29.57,41 28.8,41 27.58,42.22 27.58,46.63 19.66,54.56 10.97,54.56 X2.24
N$57  (via drill 0.35)
  Top 0.152: v86.72,28.96 80.77,34.9 62.18,34.9 60.2,36.88 60.2,39.17 60.5,39.47 61.11,39.47 IC1.36
  Bottom 0.152: v86.72,28.96 87.78,28.96 90.07,26.67 X3.49
N$58  (via drill 0.35)
  Top 0.152: v62.64,40.39 61.27,40.39 IC1.37
  Bottom 0.152: v62.64,40.39 62.64,41.45 67.21,46.02 73.3,46.02 83.52,56.24 89.15,56.24 89.61,56.69 91.75,56.69 92.05,56.39 92.05,28.65 91.44,28.04 90.83,28.04 X3.48
N$59  (via drill 0.35)
  Top 0.152: v85.65,33.07 80.92,37.8 68.12,37.8 64.77,41.15 61.27,41.15 IC1.38 | v88.39,30.94 v85.65,30.94
  Bottom 0.152: v85.65,30.94 v85.65,33.07 | v88.39,30.94 90.07,29.26 90.68,29.26 X3.47
N$60  (via drill 0.35)
  Top 0.152: v64.01,41.91 61.27,41.91 IC1.39
  Bottom 0.152: v64.01,41.91 67.82,45.72 78.03,45.72 82.75,50.44 84.89,50.44 89.31,46.02 89.31,31.24 90.07,30.48 X3.46
N$61  (via drill 0.35)
  Top 0.152: v44.2,47.09 44.5,46.79 45.41,46.79 IC1.4 | v42.98,48.31 42.22,48.31 41,47.09 36.12,47.09 v35.81,47.4 | v26.36,46.94 24.84,46.94 19.36,52.43 12.5,52.43 11.58,53.34 X2.23
  Bottom 0.152: v42.98,48.31 v44.2,47.09 | v35.81,47.4 26.82,47.4 v26.36,46.94
N$62  (via drill 0.35)
  Top 0.152: v43.74,42.67 45.41,42.67 IC1.9 | v38.71,40.84 33.38,40.84 v24.23,31.7 | v7.16,48.92 10.21,51.97 10.82,51.97 X2.22
  Bottom 0.152: v43.74,42.67 40.54,42.67 v38.71,40.84 | v24.23,31.7 18.14,31.7 13.41,26.98 13.41,25.6 12.04,24.23 9.75,24.23 7.16,26.82 v7.16,48.92
N$63  (via drill 0.35)
  Top 0.152: v48.62,52.58 49.68,51.51 49.68,51.05 IC1.61 | v21.95,54.71 v31.55,54.71 | v19.05,51.82 12.5,51.82 11.58,50.9 10.97,50.9 X2.21
  Bottom 0.152: v48.62,52.58 47.24,52.58 45.11,54.71 v31.55,54.71 | v19.05,51.82 v21.95,54.71
N$64  (via drill 0.35)
  Top 0.152: v51.21,52.27 50.6,51.66 50.6,51.05 IC1.60 | v33.68,55.93 30.94,53.19 26.82,53.19 v24.38,50.75 | v19.05,49.99 11.43,49.99 10.97,49.53 X2.20
  Bottom 0.152: v51.21,52.27 51.21,52.73 48.01,55.93 v33.68,55.93 | v24.38,50.75 19.81,50.75 v19.05,49.99
N$65  (via drill 0.35)
  Top 0.152: v59.89,48.46 61.11,48.46 IC1.47 | v25.15,68.28 v46.63,68.28 | v7.77,45.72 10.21,43.28 10.82,43.28 X2.15
  Bottom 0.152: v59.89,48.46 58.83,48.46 49.68,57.61 49.68,66.14 48.31,67.51 47.4,67.51 v46.63,68.28 | v25.15,68.28 21.34,72.08 17.98,72.08 7.77,61.87 v7.77,45.72
N$66  (via drill 0.35)
  Top 0.152: v62.33,37.95 61.27,37.95 IC1.34 | v46.48,26.67 v52.12,32.31 | v14.02,26.67 11.89,24.54 9.91,24.54 6.25,28.19 6.25,53.19 10.06,57 v10.36,57
  Bottom 0.152: v62.33,37.95 57.76,37.95 v52.12,32.31 | v14.02,26.67 v46.48,26.67 | v10.36,57 10.06,57 9.6,56.54 9.6,53.95 10.21,53.34 X2.48
N$67
  Top 0.152: IC1.48 61.27,49.07 66.6,49.07 67.36,48.31 78.03,48.31 83.52,42.82 87.94,42.82 90.07,40.69 90.68,40.69 X3.13
N$68  (via drill 0.35)
  Top 0.152: v59.28,45.72 59.28,50.9 IC1.49 | v86.41,35.81 89.92,39.32 90.68,39.32 X3.14
  Bottom 0.152: v59.28,45.72 59.28,42.37 65.84,35.81 v86.41,35.81
N$69  (via drill 0.35)
  Top 0.152: v62.33,37.03 61.27,37.03 IC1.33 | v35.66,44.81 v39.62,40.84 | v26.98,45.72 24.84,45.72 19.96,50.6 v12.95,50.6
  Bottom 0.152: v62.33,37.03 62.94,37.64 62.94,38.25 61.42,39.78 54.1,39.78 50.9,36.58 47.7,36.58 43.43,40.84 v39.62,40.84 | v35.66,44.81 30.63,44.81 29.41,46.02 27.28,46.02 v26.98,45.72 | v12.95,50.6 11.58,51.97 10.97,51.97 X2.47
N$70  (via drill 0.35)
  Top 0.152: v28.5,43.89 32,47.4 34.44,47.4 42.06,55.02 42.98,55.02 44.81,53.19 51.21,53.19 51.82,52.58 51.82,51.97 51.36,51.51 51.36,51.05 IC1.59 | v22.25,43.89 19.81,43.89 11.58,35.66 10.97,35.66 X2.9
  Bottom 0.152: v22.25,43.89 v28.5,43.89
VCC  (via drill 0.35)
  Top 0.152: IC5.19 IC5.18 | v21.03,32.92 18.44,35.51 L1.1
  Bottom 0.152: v21.03,32.92 50.6,32.92 57.15,26.36 75.29,26.36 76.2,25.45 | IC5.18 83.82,48.92 88.24,44.5 88.24,32.61 81.08,25.45 76.2,25.45 | 76.2,25.45 IC3.16